# EAGLE schematic TK90X (EAGLE 7.4.0)
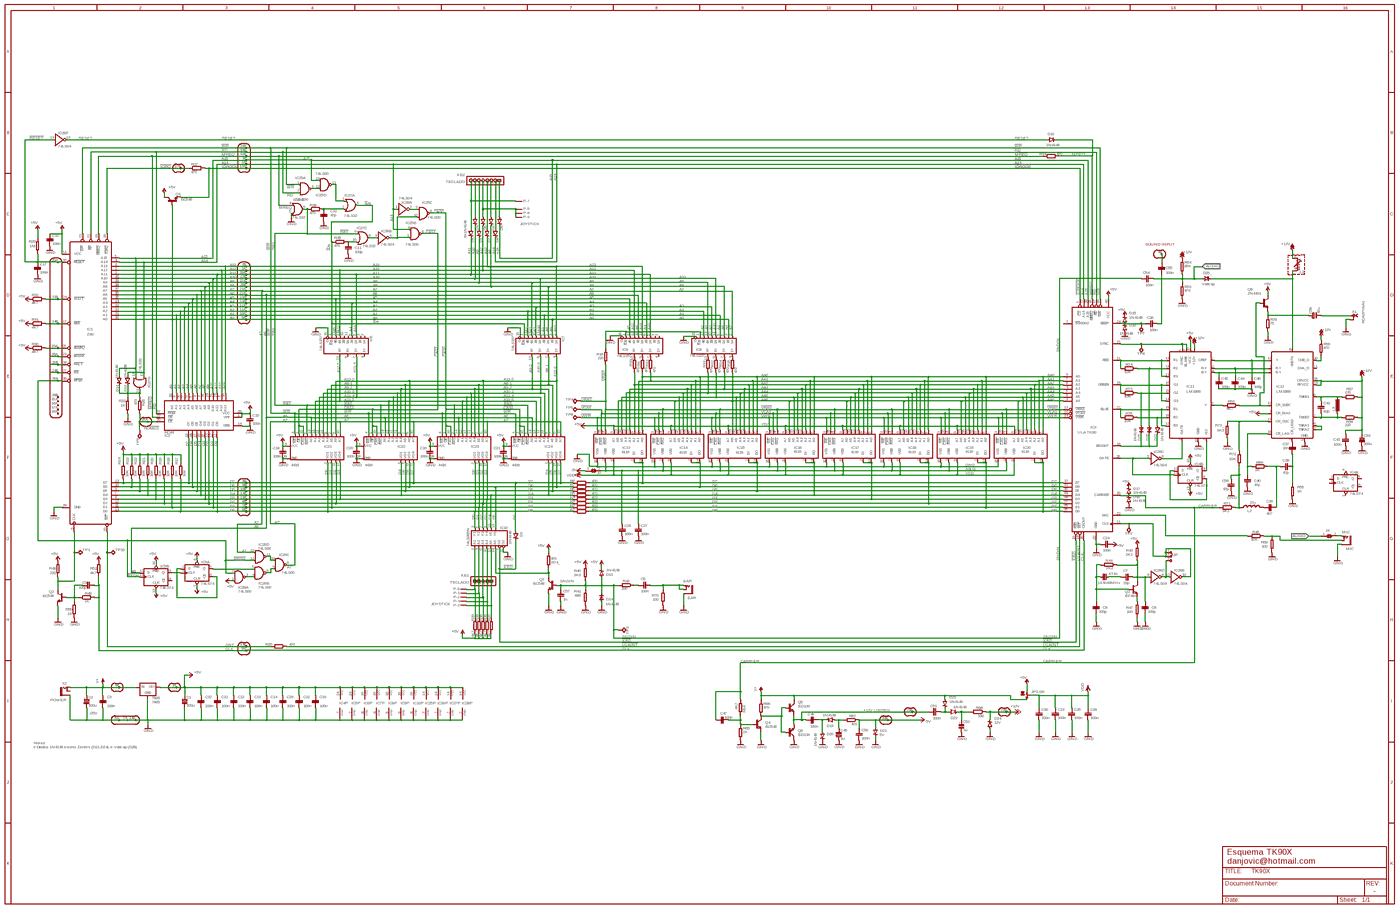
[diagram p0: schematic, sheet 1, overview]
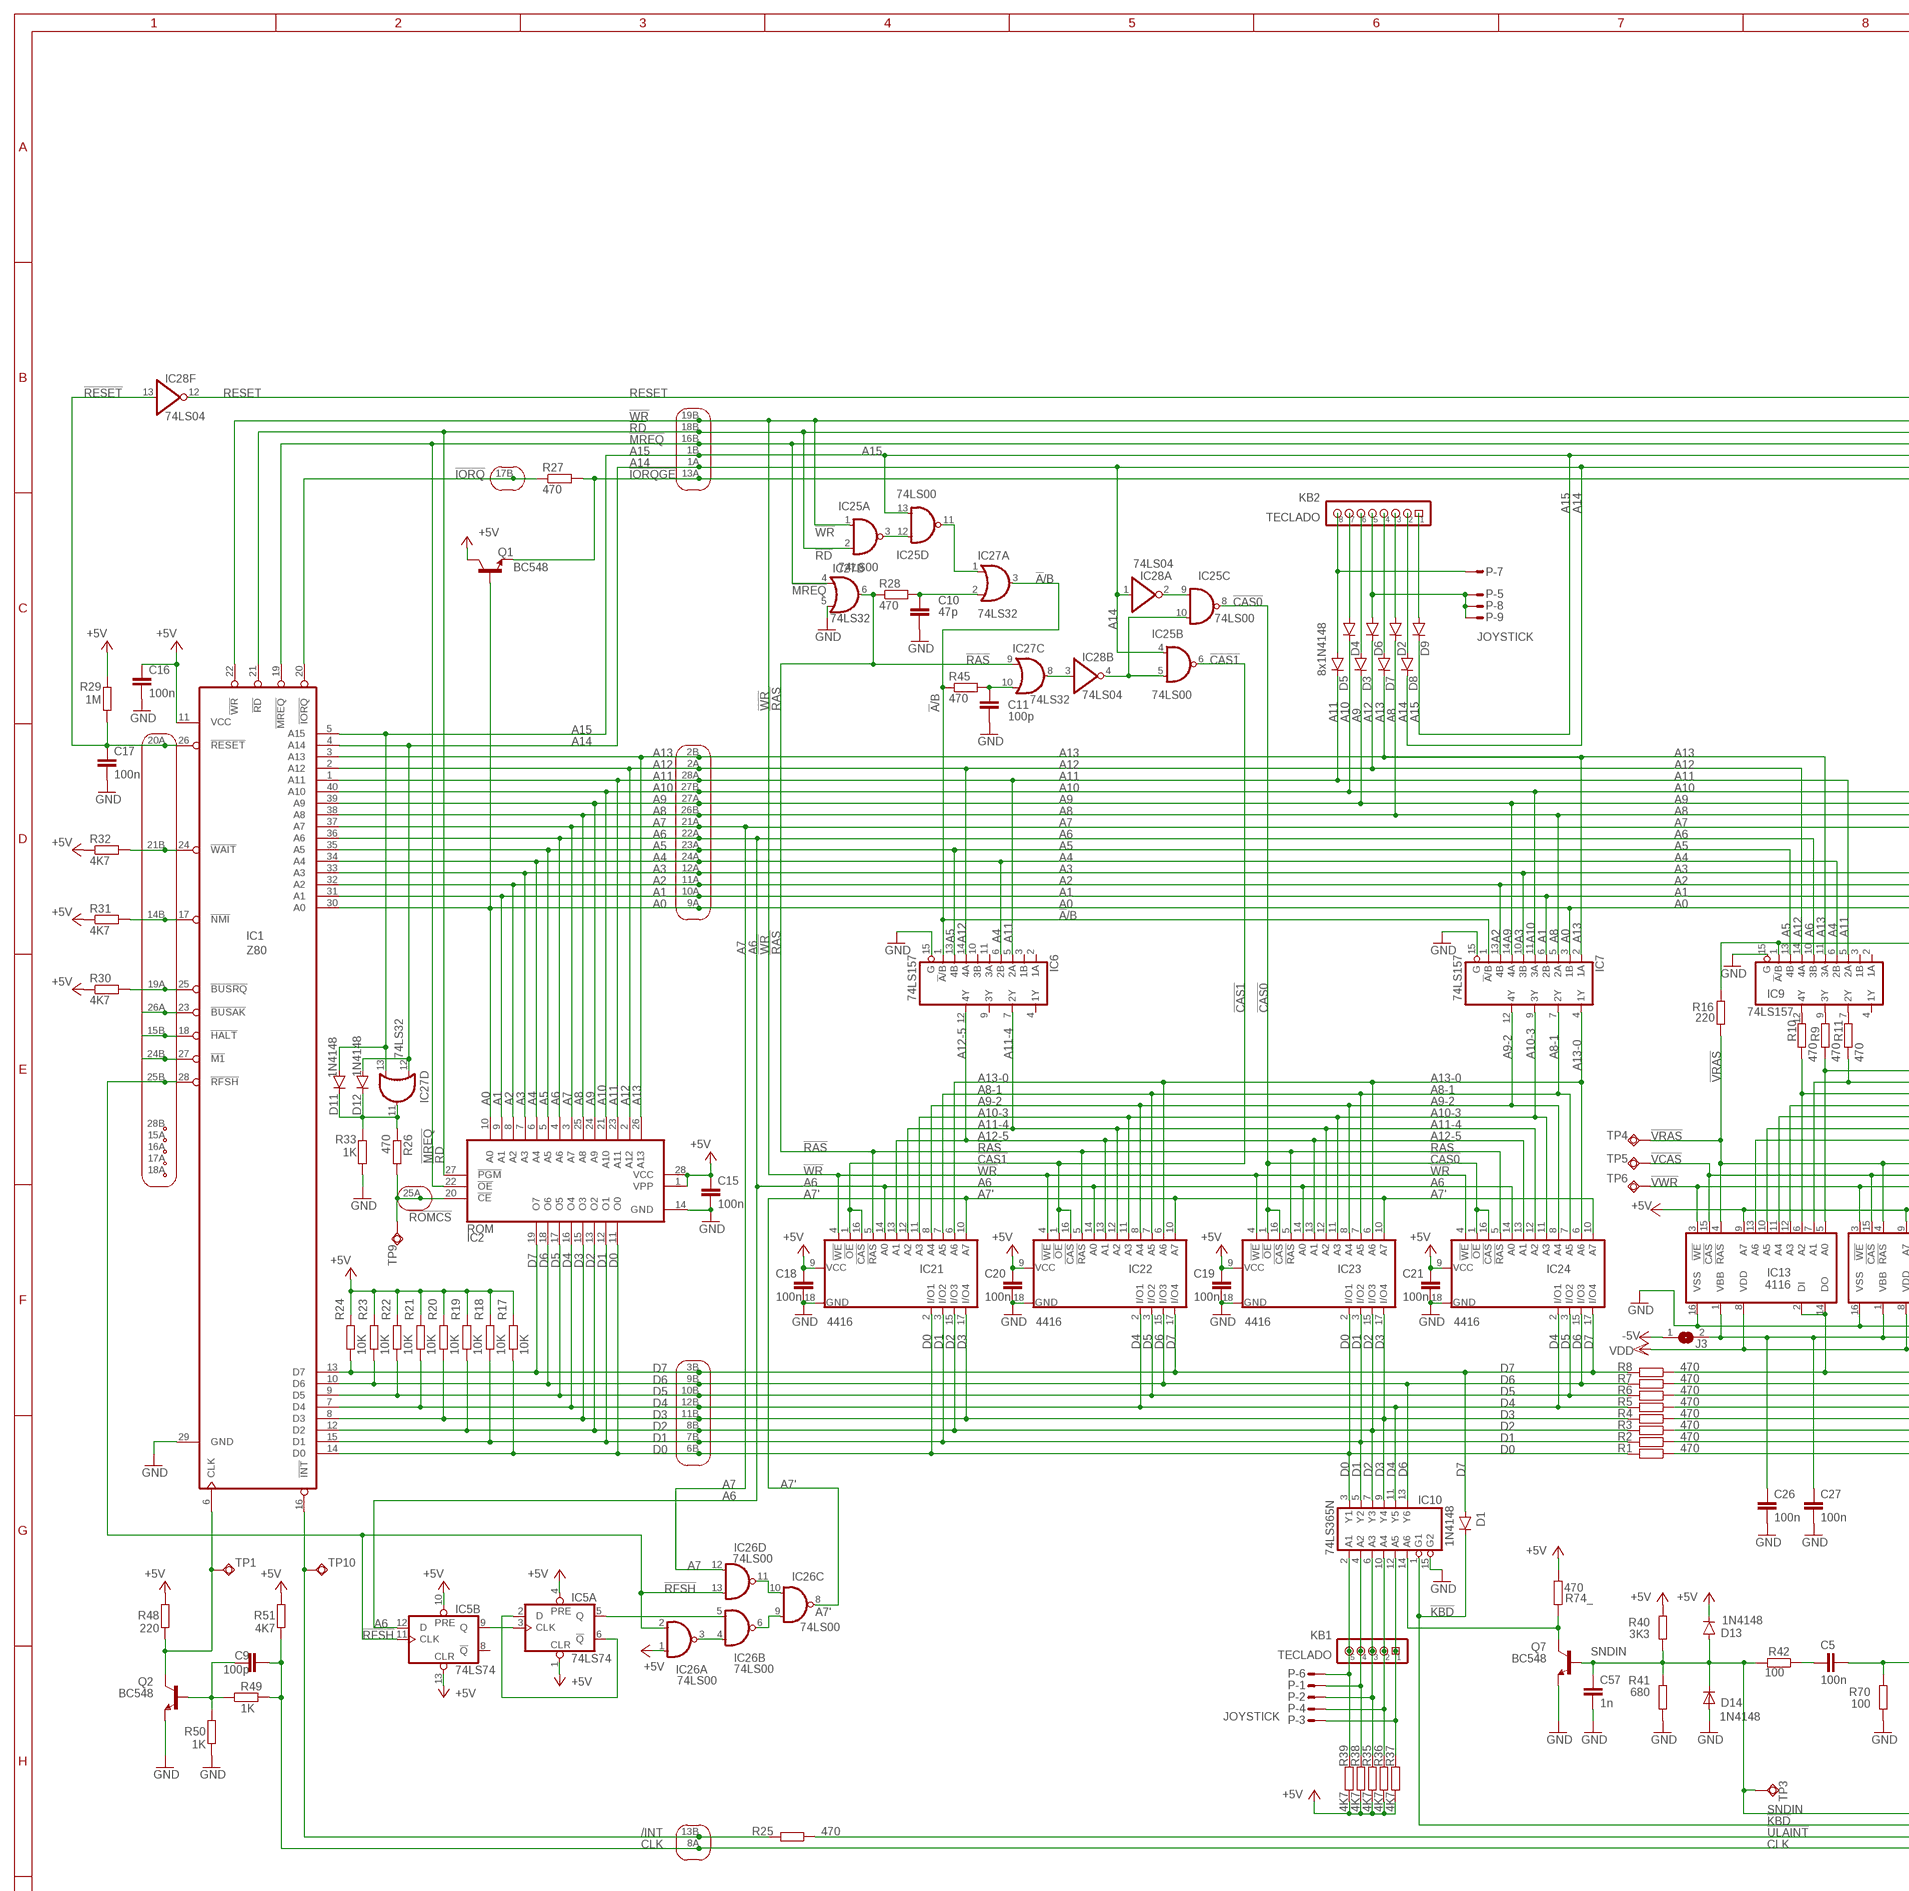
[diagram p1: schematic, sheet 1, part 1 of 4]
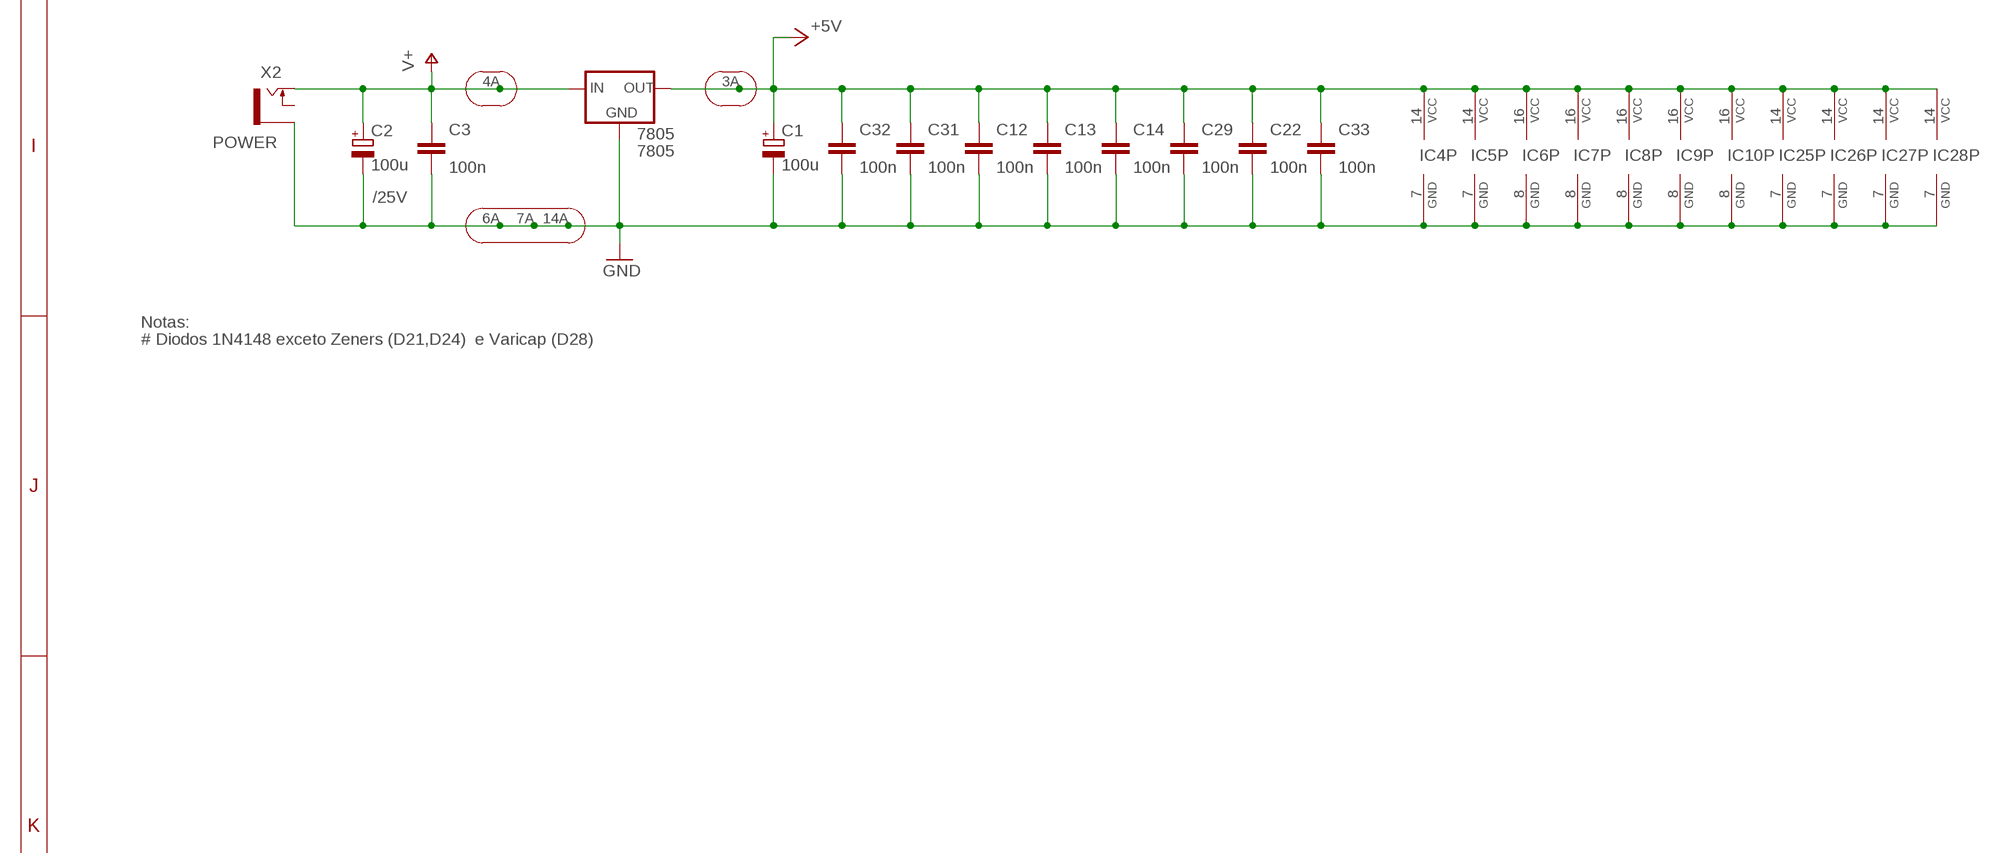
[diagram p2: schematic, sheet 1, part 2 of 4]
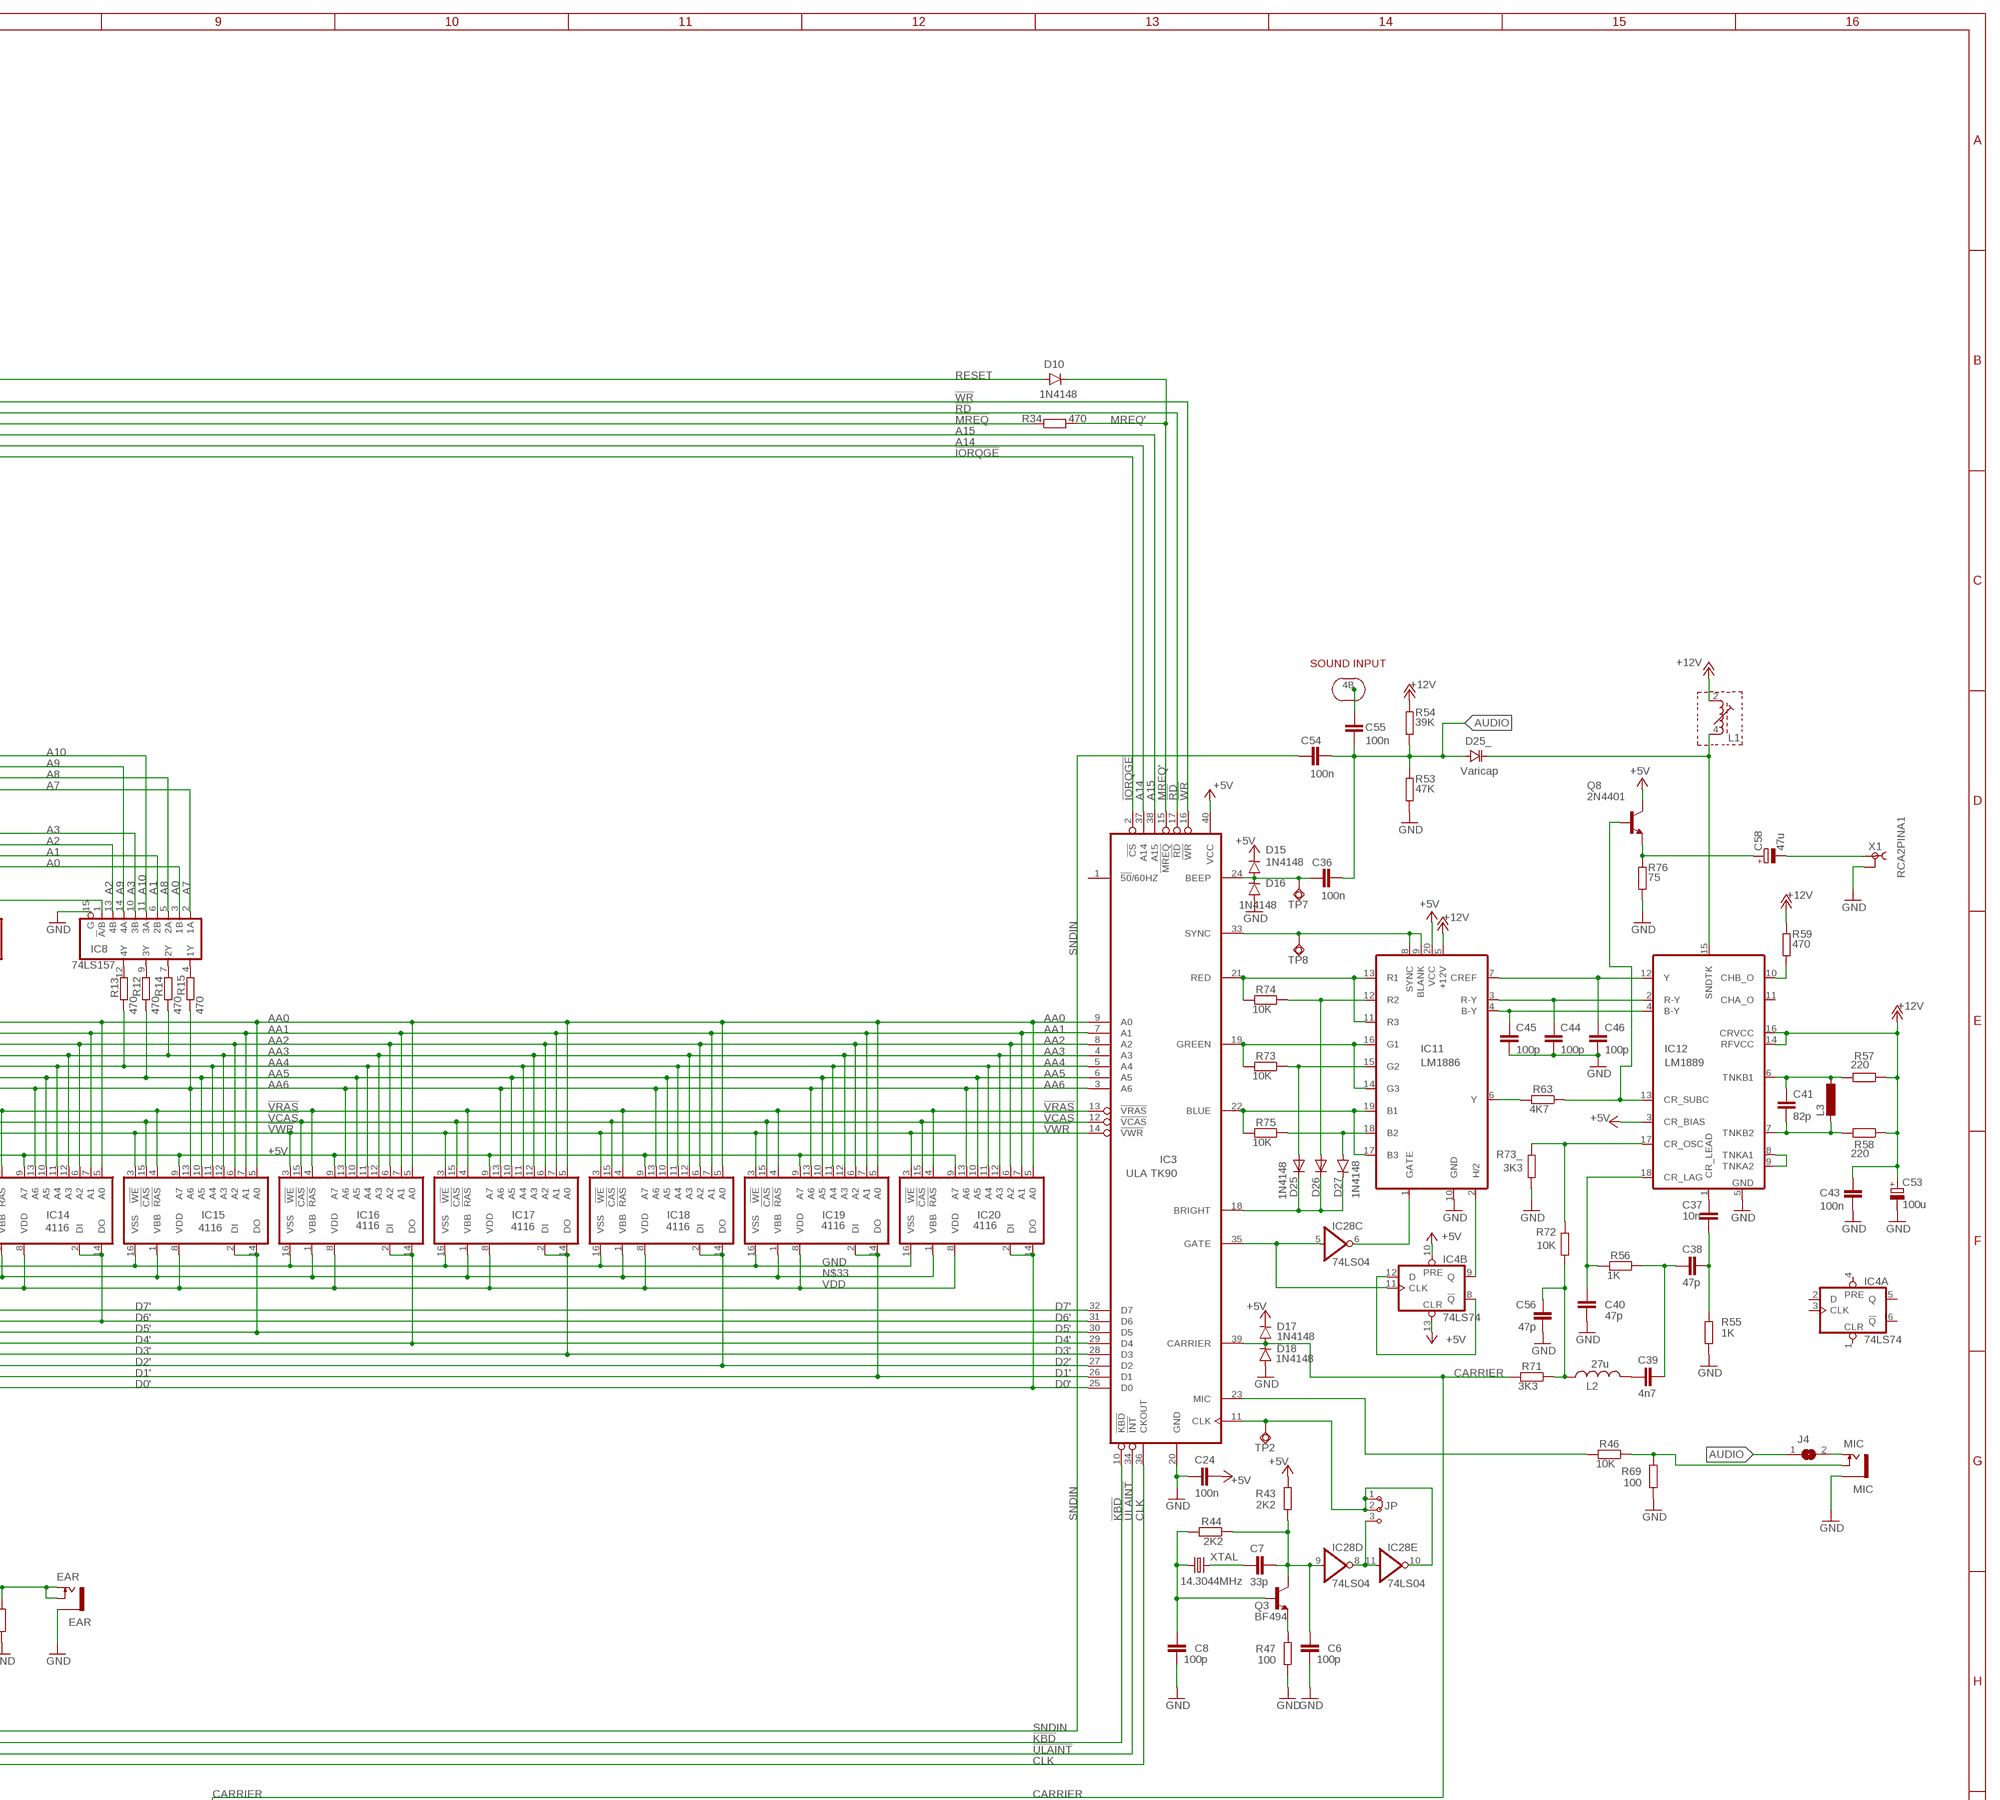
[diagram p3: schematic, sheet 1, part 3 of 4]
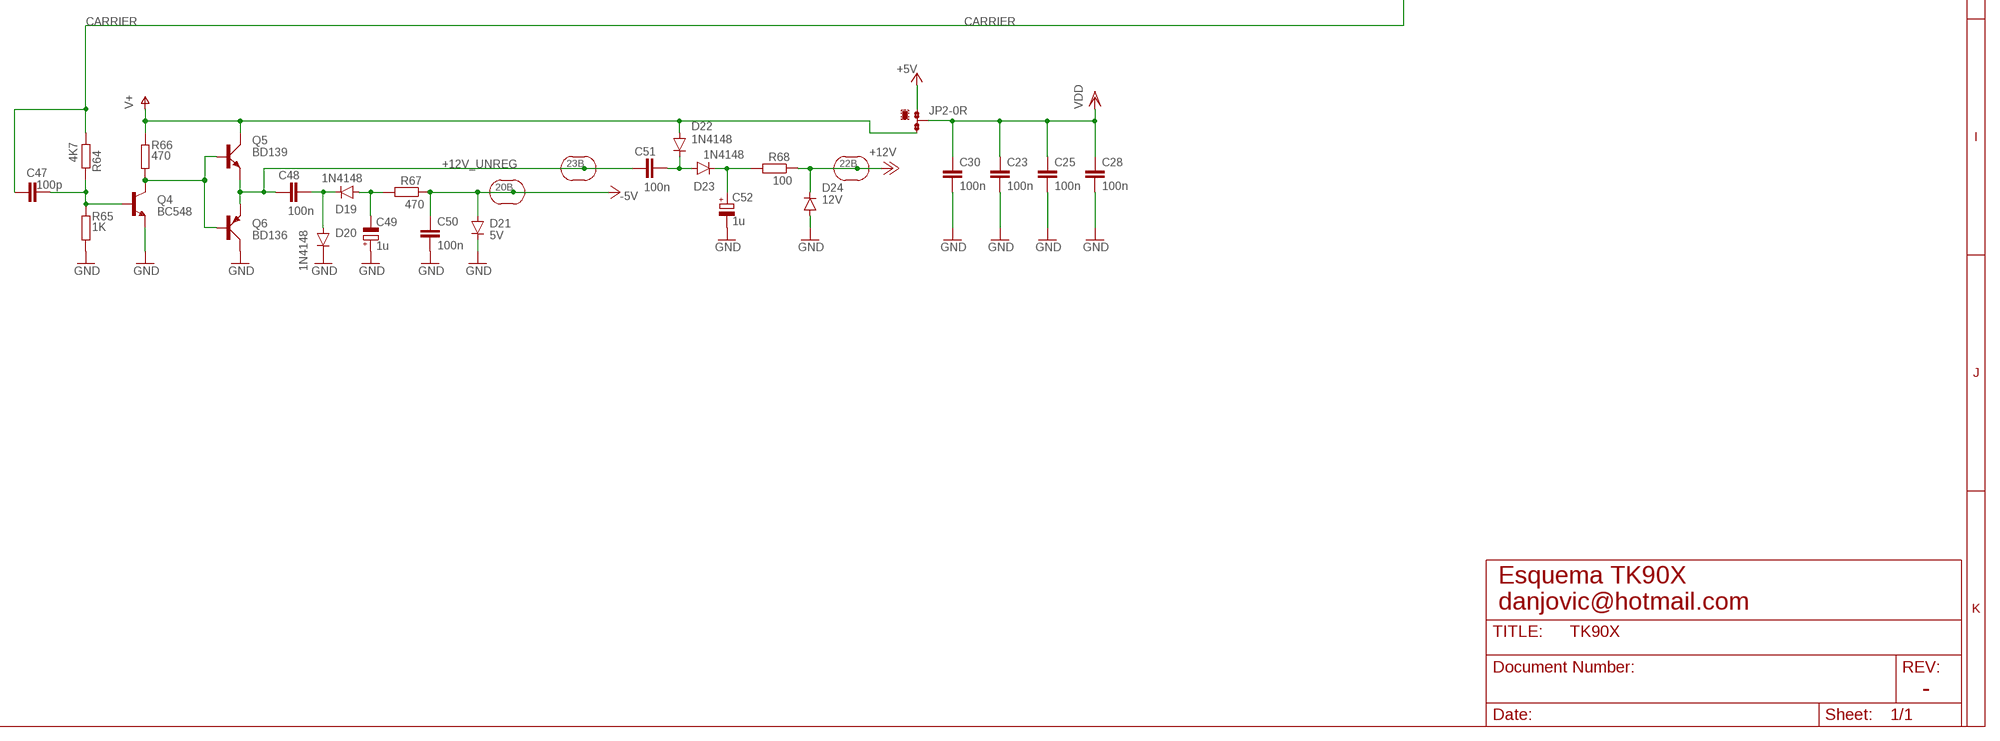
[diagram p4: schematic, sheet 1, part 4 of 4]

## Parts
7805  7805  78XXL  [78XXL]
C1  100u  CPOL-EUE5-8.5  [E5-8,5]
C2  100u  CPOL-EUE5-8.5  [E5-8,5]
C3  100n  C-EU050-024X044  [C050-024X044]
C5  100n  C-EU050-024X044  [C050-024X044]
C6  100p  C-EU050-024X044  [C050-024X044]
C7  33p  C-EU050-024X044  [C050-024X044]
C8  100p  C-EU050-024X044  [C050-024X044]
C9  100p  C-EU050-024X044  [C050-024X044]
C10  47p  C-EU050-024X044  [C050-024X044]
C11  100p  C-EU050-024X044  [C050-024X044]
C12  100n  C-EU050-024X044  [C050-024X044]
C13  100n  C-EU050-024X044  [C050-024X044]
C14  100n  C-EU050-024X044  [C050-024X044]
C15  100n  C-EU050-024X044  [C050-024X044]
C16  100n  C-EU050-024X044  [C050-024X044]
C17  100n  C-EU050-024X044  [C050-024X044]
C18  100n  C-EU050-024X044  [C050-024X044]
C19  100n  C-EU050-024X044  [C050-024X044]
C20  100n  C-EU050-024X044  [C050-024X044]
C21  100n  C-EU050-024X044  [C050-024X044]
C22  100n  C-EU050-024X044  [C050-024X044]
C23  100n  C-EU050-024X044  [C050-024X044]
C24  100n  C-EU050-024X044  [C050-024X044]
C25  100n  C-EU050-024X044  [C050-024X044]
C26  100n  C-EU050-024X044  [C050-024X044]
C27  100n  C-EU050-024X044  [C050-024X044]
C28  100n  C-EU050-024X044  [C050-024X044]
C29  100n  C-EU050-024X044  [C050-024X044]
C30  100n  C-EU050-024X044  [C050-024X044]
C31  100n  C-EU050-024X044  [C050-024X044]
C32  100n  C-EU050-024X044  [C050-024X044]
C33  100n  C-EU050-024X044  [C050-024X044]
C36  100n  C-EU050-024X044  [C050-024X044]
C37  10n  C-EU050-024X044  [C050-024X044]
C38  47p  C-EU050-024X044  [C050-024X044]
C39  4n7  C-EU050-024X044  [C050-024X044]
C40  47p  C-EU050-024X044  [C050-024X044]
C41  82p  C-EU050-024X044  [C050-024X044]
C43  100n  C-EU050-024X044  [C050-024X044]
C44  100p  C-EU050-024X044  [C050-024X044]
C45  100p  C-EU050-024X044  [C050-024X044]
C46  100p  C-EU050-024X044  [C050-024X044]
C47  100p  C-EU050-024X044  [C050-024X044]
C48  100n  C-EU050-024X044  [C050-024X044]
C49  1u  CPOL-EUE2-4  [E2-4]
C50  100n  C-EU050-024X044  [C050-024X044]
C51  100n  C-EU050-024X044  [C050-024X044]
C52  1u  CPOL-EUE2-5  [E2-5]
C53  100u  CPOL-EUE5-4  [E5-4]
C54  100n  C-EU050-024X044  [C050-024X044]
C55  100n  C-EU050-024X044  [C050-024X044]
C56  47p  C-EU050-024X044  [C050-024X044]
C57  1n  C-EU050-024X044  [C050-024X044]
C58  47u  CPOL-EUE5-4  [E5-4]
D1  1N4148  DDO35-12  [DO35-12]
D2  1N4148  DDO35-12  [DO35-12]
D3  1N4148  DDO35-12  [DO35-12]
D4  1N4148  DDO35-12  [DO35-12]
D5  1N4148  DDO35-12  [DO35-12]
D6  1N4148  DDO35-12  [DO35-12]
D7  1N4148  DDO35-12  [DO35-12]
D8  1N4148  DDO35-12  [DO35-12]
D9  1N4148  DDO35-12  [DO35-12]
D10  1N4148  DDO35-12  [DO35-12]
D11  1N4148  DDO35-12  [DO35-12]
D12  1N4148  DDO35-12  [DO35-12]
D13  1N4148  DDO35-12  [DO35-12]
D14  1N4148  DIODE-D-5  [D-5]
D15  1N4148  DDO35-12  [DO35-12]
D16  1N4148  DDO35-12  [DO35-12]
D17  1N4148  DDO35-12  [DO35-12]
D18  1N4148  DDO35-12  [DO35-12]
D19  1N4148  DDO35-12  [DO35-12]
D20  1N4148  DDO35-12  [DO35-12]
D21  5V  DDO35-12  [DO35-12]
D22  1N4148  DDO35-12  [DO35-12]
D23  1N4148  DDO35-12  [DO35-12]
D24  12V  DDO35-12  [DO35-12]
D25  1N4148  DIODE-D-5  [D-5]
D25_  Varicap  VARICAP-200  [D200]
D26  1N4148  DIODE-D-5  [D-5]
D27  1N4148  DDO35-12  [DO35-12]
EAR  EAR  JACK-MONO  [MONO]
IC1  Z80  Z80CPU  [DIL40]
IC2  ROM  25128  [DIL28]
IC3  ULA TK90  ULA-TK90  [DIL40]
IC4  74LS74  74LS74N  [DIL14]
IC5  74LS74  74LS74N  [DIL14]
IC6  74LS157  74S157N  [DIL16]
IC7  74LS157  74S157N  [DIL16]
IC8  74LS157  74S157N  [DIL16]
IC9  74LS157  74S157N  [DIL16]
IC10  74LS365N  [DIL16]
IC11  LM1886  LM1886N  [DIL20]
IC12  LM1889  [DIL18]
IC13  4116  MK4516  [DIL16]
IC14  4116  MK4516  [DIL16]
IC15  4116  MK4516  [DIL16]
IC16  4116  MK4516  [DIL16]
IC17  4116  MK4516  [DIL16]
IC18  4116  MK4516  [DIL16]
IC19  4116  MK4516  [DIL16]
IC20  4116  MK4516  [DIL16]
IC21  4416  [DIL18]
IC22  4416  [DIL18]
IC23  4416  [DIL18]
IC24  4416  [DIL18]
IC25  74LS00  74LS00N  [DIL14]
IC26  74LS00  74LS00N  [DIL14]
IC27  74LS32  74LS32N  [DIL14]
IC28  74LS04  74LS04N  [DIL14]
J3  SJ  [SJ]
J4  SJ  [SJ]
JP  J2X1MM  [03C]
JP2  0R-JUMPB  [B0R-JMP]
KB1  TECLADO  CON-TECL-5  [FE05-1]
KB2  TECLADO  CON-TECL-8  [FE08]
L1  COIL  [COIL]
L2  27u  L-US0207/7  [0207/7]
L3  L-EU0204/5  [0204/5]
MIC  MIC  JACK-MONO  [MONO]
P  JOYSTICK  M09.590S  [177-009-MALE]
Q1  BC548  -NPN-TO92L  [TO92L]
Q2  BC548  -NPN-TO92L  [TO92L]
Q3  BF494  [TO92-CEB]
Q4  BC548  -NPN-TO92L  [TO92L]
Q5  BD139  [TO126AV]
Q6  BD136  BD140  [TO126AV]
Q7  BC548  -NPN-TO92L  [TO92L]
Q8  2N4401  [TO92-EBC]
R1  470  R-EU_0207/12  [0207/12]
R2  470  R-EU_0207/12  [0207/12]
R3  470  R-EU_0207/12  [0207/12]
R4  470  R-EU_0207/12  [0207/12]
R5  470  R-EU_0207/12  [0207/12]
R6  470  R-EU_0207/12  [0207/12]
R7  470  R-EU_0207/12  [0207/12]
R8  470  R-EU_0207/12  [0207/12]
R9  470  R-EU_0207/12  [0207/12]
R10  470  R-EU_0207/12  [0207/12]
R11  470  R-EU_0207/12  [0207/12]
R12  470  R-EU_0207/12  [0207/12]
R13  470  R-EU_0207/12  [0207/12]
R14  470  R-EU_0207/12  [0207/12]
R15  470  R-EU_0207/12  [0207/12]
R16  220  R-EU_0207/12  [0207/12]
R17  10K  R-EU_0207/12  [0207/12]
R18  10K  R-EU_0207/12  [0207/12]
R19  10K  R-EU_0207/12  [0207/12]
R20  10K  R-EU_0207/12  [0207/12]
R21  10K  R-EU_0207/12  [0207/12]
R22  10K  R-EU_0207/12  [0207/12]
R23  10K  R-EU_0207/12  [0207/12]
R24  10K  R-EU_0207/12  [0207/12]
R25  470  R-EU_0207/12  [0207/12]
R26  470  R-EU_0207/12  [0207/12]
R27  470  R-EU_0207/12  [0207/12]
R28  470  R-EU_0207/12  [0207/12]
R29  1M  R-EU_0207/12  [0207/12]
R30  4K7  R-EU_0207/12  [0207/12]
R31  4K7  R-EU_0207/12  [0207/12]
R32  4K7  R-EU_0207/12  [0207/12]
R33  1K  R-EU_0207/12  [0207/12]
R34  470  R-EU_0207/12  [0207/12]
R35  4K7  R-EU_0207/12  [0207/12]
R36  4K7  R-EU_0207/12  [0207/12]
R37  4K7  R-EU_0207/12  [0207/12]
R38  4K7  R-EU_0207/12  [0207/12]
R39  4K7  R-EU_0207/12  [0207/12]
R40  3K3  R-EU_0207/12  [0207/12]
R41  680  R-EU_0207/5V  [0207/5V]
R42  100  R-EU_0207/5V  [0207/5V]
R43  2K2  R-EU_0207/12  [0207/12]
R44  2K2  R-EU_0207/12  [0207/12]
R45  470  R-EU_0207/12  [0207/12]
R46  10K  R-EU_0207/12  [0207/12]
R47  100  R-EU_0207/12  [0207/12]
R48  220  R-EU_0207/12  [0207/12]
R49  1K  R-EU_0207/12  [0207/12]
R50  1K  R-EU_0207/12  [0207/12]
R51  4K7  R-EU_0207/12  [0207/12]
R53  47K  R-EU_0207/12  [0207/12]
R54  39K  R-EU_0207/12  [0207/12]
R55  1K  R-EU_0207/5V  [0207/5V]
R56  1K  R-EU_0207/5V  [0207/5V]
R57  220  R-EU_0207/5V  [0207/5V]
R58  220  R-EU_0207/5V  [0207/5V]
R59  470  R-EU_0207/5V  [0207/5V]
R63  4K7  R-EU_0207/12  [0207/12]
R64  4K7  R-EU_0207/12  [0207/12]
R65  1K  R-EU_0207/12  [0207/12]
R66  470  R-EU_0207/12  [0207/12]
R67  470  R-EU_0207/12  [0207/12]
R68  100  R-EU_0207/12  [0207/12]
R69  100  R-EU_0207/5V  [0207/5V]
R70  100  R-EU_0207/5V  [0207/5V]
R71  3K3  R-EU_0207/5V  [0207/5V]
R72  10K  R-EU_0207/5V  [0207/5V]
R73  10K  R-EU_0207/5V  [0207/5V]
R73_  3K3  R-EU_0207/12  [0207/12]
R74  10K  R-EU_0207/5V  [0207/5V]
R74_  470  R-EU_0207/12  [0207/12]
R75  10K  R-EU_0207/12  [0207/12]
R76  75  R-EU_0207/5V  [0207/5V]
TP1  TPSQPAD1-13  [P1-13]
TP2  TPSQPAD1-13  [P1-13]
TP3  TPSQPAD1-13  [P1-13]
TP4  TPSQPAD1-13  [P1-13]
TP5  TPSQPAD1-13  [P1-13]
TP6  TPSQPAD1-13  [P1-13]
TP7  TPSQPAD1-13  [P1-13]
TP8  TPSQPAD1-13  [P1-13]
TP9  TPSQPAD1-13  [P1-13]
TP10  TPSQPAD1-13  [P1-13]
U$1  TK90_EDGE  [TK-EDGE]
X1  RCA2PINA1  [TOBU3]
X2  POWER  JACK-MONO  [MONO]
XTAL  14.3044MHz  CRYSTALHC49S  [HC49/S]

## Nets
!A!/B: IC6.1(!A!/B) IC7.1(!A!/B) IC27.3(A:O) R45.1
!BUSAK: IC1.23(!BUSAK) U$1.26A
!BUSRQ: IC1.25(!BUSRQ) R30.2 U$1.19A
!CAS0: IC23.1(!OE) IC23.16(!CAS) IC24.1(!OE) IC24.16(!CAS) IC25.8(C:O)
!CAS1: IC21.1(!OE) IC21.16(!CAS) IC22.1(!OE) IC22.16(!CAS) IC25.6(B:O)
!HALT: IC1.18(!HALT) U$1.15B
!IORQ: IC1.20(!IORQ) R27.1 U$1.17B
!IORQGE: IC3.2(!CS) Q1.1(E) R27.2 U$1.13A
!KBD: D1.C(K) IC3.10(!KBD) IC10.1(G1)
!M1: IC1.27(!M1) U$1.24B
!MREQ: IC1.19(!MREQ) IC2.22(!OE) IC27.4(B:I0) R34.1 U$1.16B
!NMI: IC1.17(!NMI) R31.2 U$1.14B
!RAS: IC21.5(!RAS) IC22.5(!RAS) IC23.5(!RAS) IC24.5(!RAS) IC27.6(B:O) IC27.9(C:I0) R28.1
!RD: IC1.21(!RD) IC2.27(!PGM) IC3.17(!RD) IC25.2(A:I1) U$1.18B
!RESET: C17.1 IC1.26(!RESET) IC28.13(F:I) R29.1 U$1.20A
!RFSH: IC1.28(!RFSH) IC5.11(B:CLK) IC26.2(A:I1) IC26.13(D:I1) U$1.25B
!ROMCS: IC2.20(!CE) R26.2 TP9.1(TP) U$1.25A
!ULAINT: IC3.34(!INT) R25.1
!VCAS: IC3.12(!VCAS) IC13.15(!CAS) IC14.15(!CAS) IC15.15(!CAS) IC16.15(!CAS) IC17.15(!CAS) IC18.15(!CAS) IC19.15(!CAS) IC20.15(!CAS) TP5.1(TP)
!VRAS: IC3.13(!VRAS) IC13.4(!RAS) IC14.4(!RAS) IC15.4(!RAS) IC16.4(!RAS) IC17.4(!RAS) IC18.4(!RAS) IC19.4(!RAS) IC20.4(!RAS) R16.2 TP4.1(TP)
!VWR: IC3.14(!VWR) IC13.3(!WE) IC14.3(!WE) IC15.3(!WE) IC16.3(!WE) IC17.3(!WE) IC18.3(!WE) IC19.3(!WE) IC20.3(!WE) TP6.1(TP)
!WAIT: IC1.24(!WAIT) R32.2 U$1.21B
!WR: IC1.22(!WR) IC3.16(!WR) IC21.4(!WE) IC22.4(!WE) IC23.4(!WE) IC24.4(!WE) IC25.1(A:I0) U$1.19B
+5V [power]: 7805.OUT C1.+ C12.2 C13.2 C14.2 C15.1 C16.1 C18.1 C19.1 C20.1 C21.1 C22.2 C24.2 C29.2 C31.2 C32.2 C33.2 D13.C(K) D15.C(K) D17.C(K) IC1.11(VCC) IC2.1(VPP) IC2.28(VCC) IC3.40(VCC) IC4.10(B:PRE) IC4.13(B:CLR) IC4.14(P:VCC) IC5.1(A:CLR) IC5.4(A:PRE) IC5.10(B:PRE) IC5.13(B:CLR) IC5.14(P:VCC) IC6.16(VCC) IC7.16(VCC) IC8.16(VCC) IC9.16(VCC) IC10.16(VCC) IC11.20(VCC) IC12.3(CR_BIAS) IC13.9(A7) IC14.9(A7) IC15.9(A7) IC16.9(A7) IC17.9(A7) IC18.9(A7) IC19.9(A7) IC20.9(A7) IC21.9(VCC) IC22.9(VCC) IC23.9(VCC) IC24.9(VCC) IC25.14(P:VCC) IC26.1(A:I0) IC26.14(P:VCC) IC27.14(P:VCC) IC28.14(P:VCC) JP2.1 Q1.3(C) Q8.C R17.2 R18.2 R19.2 R20.2 R21.2 R22.2 R23.2 R24.2 R29.2 R30.1 R31.1 R32.1 R35.1 R36.1 R37.1 R38.1 R39.1 R40.2 R43.2 R48.2 R51.2 R74_.2 U$1.3A
+12V [power]: C43.2 C53.+ D24.C(K) IC11.5(+12V) IC12.14(RFVCC) IC12.16(CRVCC) L1.2(A) R54.1 R57.1 R58.1 R59.1 R68.1 U$1.22B
+12V_UNREG: C48.1 C51.1 Q5.E Q6.E U$1.23B
-5V [power]: C50.1 D21.A J3.1 R67.1 U$1.20B
/INT: IC1.16(!INT) R25.2 TP10.1(TP) U$1.13B
A0: IC1.30(A0) IC2.10(A0) IC7.3(1B) IC8.3(1B) Q1.2(B) U$1.9A
A1: IC1.31(A1) IC2.9(A1) IC7.6(2B) IC8.6(2B) U$1.10A
A2: IC1.32(A2) IC2.8(A2) IC7.13(4B) IC8.13(4B) U$1.11A
A3: IC1.33(A3) IC2.7(A3) IC7.10(3B) IC8.10(3B) U$1.12A
A4: IC1.34(A4) IC2.6(A4) IC6.6(2B) IC9.6(2B) U$1.24A
A5: IC1.35(A5) IC2.5(A5) IC6.13(4B) IC9.13(4B) U$1.23A
A6: IC1.36(A6) IC2.4(A6) IC5.12(B:D) IC9.10(3B) IC21.14(A0) IC22.14(A0) IC23.14(A0) IC24.14(A0) U$1.22A
A7: IC1.37(A7) IC2.3(A7) IC8.2(1A) IC26.12(D:I0) U$1.21A
A7': IC21.10(A7) IC22.10(A7) IC23.10(A7) IC24.10(A7) IC26.8(C:O)
A8: D2.C(K) IC1.38(A8) IC2.25(A8) IC7.5(2A) IC8.5(2A) U$1.26B
A8-1: IC7.7(2Y) IC21.7(A5) IC22.7(A5) IC23.7(A5) IC24.7(A5)
A9: D3.C(K) IC1.39(A9) IC2.24(A9) IC7.14(4A) IC8.14(4A) U$1.27A
A9-2: IC7.12(4Y) IC21.8(A4) IC22.8(A4) IC23.8(A4) IC24.8(A4)
A10: D4.C(K) IC1.40(A10) IC2.21(A10) IC7.11(3A) IC8.11(3A) U$1.27B
A10-3: IC7.9(3Y) IC21.11(A3) IC22.11(A3) IC23.11(A3) IC24.11(A3)
A11: D5.C(K) IC1.1(A11) IC2.23(A11) IC6.5(2A) IC9.5(2A) U$1.28A
A11-4: IC6.7(2Y) IC21.12(A2) IC22.12(A2) IC23.12(A2) IC24.12(A2)
A12: D6.C(K) IC1.2(A12) IC2.2(A12) IC6.14(4A) IC9.14(4A) U$1.2A
A12-5: IC6.12(4Y) IC21.13(A1) IC22.13(A1) IC23.13(A1) IC24.13(A1)
A13: D7.C(K) IC1.3(A13) IC2.26(A13) IC7.2(1A) IC9.11(3A) U$1.2B
A13-0: IC7.4(1Y) IC21.6(A6) IC22.6(A6) IC23.6(A6) IC24.6(A6)
A14: D8.C(K) D12.A IC1.4(A14) IC3.37(A14) IC25.4(B:I0) IC27.12(D:I0) IC28.1(A:I) U$1.1A
A15: D9.C(K) D11.A IC1.5(A15) IC3.38(A15) IC25.13(D:I1) IC27.13(D:I1) U$1.1B
AA0: IC3.9(A0) IC13.5(A0) IC14.5(A0) IC15.5(A0) IC16.5(A0) IC17.5(A0) IC18.5(A0) IC19.5(A0) IC20.5(A0) R9.1
AA1: IC3.7(A1) IC13.7(A1) IC14.7(A1) IC15.7(A1) IC16.7(A1) IC17.7(A1) IC18.7(A1) IC19.7(A1) IC20.7(A1) R11.1
AA2: IC3.8(A2) IC13.6(A2) IC14.6(A2) IC15.6(A2) IC16.6(A2) IC17.6(A2) IC18.6(A2) IC19.6(A2) IC20.6(A2) R10.1
AA3: IC3.4(A3) IC13.12(A3) IC14.12(A3) IC15.12(A3) IC16.12(A3) IC17.12(A3) IC18.12(A3) IC19.12(A3) IC20.12(A3) R14.1
AA4: IC3.5(A4) IC13.11(A4) IC14.11(A4) IC15.11(A4) IC16.11(A4) IC17.11(A4) IC18.11(A4) IC19.11(A4) IC20.11(A4) R13.1
AA5: IC3.6(A5) IC13.10(A5) IC14.10(A5) IC15.10(A5) IC16.10(A5) IC17.10(A5) IC18.10(A5) IC19.10(A5) IC20.10(A5) R12.1
AA6: IC3.3(A6) IC13.13(A6) IC14.13(A6) IC15.13(A6) IC16.13(A6) IC17.13(A6) IC18.13(A6) IC19.13(A6) IC20.13(A6) R15.1
AUDIO: C36.2 C54.2 C55.1 D25_.A J4.1 R53.1 R54.2
BEEP: C36.1 D15.A D16.C(K) IC3.24(BEEP) TP7.1(TP)
CARRIER: C47.1 D17.A D18.C(K) IC3.39(CARRIER) R64.2 R71.2
CLK: C9.2 IC3.36(CKOUT) R49.2 R51.1 U$1.8A
D0: IC1.14(D0) IC2.11(O0) IC10.3(Y1) IC21.2(I/O1) IC23.2(I/O1) R1.2 R17.1 U$1.6B
D0': IC3.25(D0) IC20.2(DI) IC20.14(DO) R1.1
D1: IC1.15(D1) IC2.12(O1) IC10.5(Y2) IC21.3(I/O2) IC23.3(I/O2) R2.2 R18.1 U$1.7B
D1': IC3.26(D1) IC19.2(DI) IC19.14(DO) R2.1
D2: IC1.12(D2) IC2.13(O2) IC10.7(Y3) IC21.15(I/O3) IC23.15(I/O3) R3.2 R19.1 U$1.8B
D2': IC3.27(D2) IC18.2(DI) IC18.14(DO) R3.1
D3: IC1.8(D3) IC2.15(O3) IC10.9(Y4) IC21.17(I/O4) IC23.17(I/O4) R4.2 R20.1 U$1.11B
D3': IC3.28(D3) IC17.2(DI) IC17.14(DO) R4.1
D4: IC1.7(D4) IC2.16(O4) IC10.11(Y5) IC22.2(I/O1) IC24.2(I/O1) R5.2 R21.1 U$1.12B
D4': IC3.29(D4) IC16.2(DI) IC16.14(DO) R5.1
D5: IC1.9(D5) IC2.17(O5) IC22.3(I/O2) IC24.3(I/O2) R6.2 R22.1 U$1.10B
D5': IC3.30(D5) IC15.2(DI) IC15.14(DO) R6.1
D6: IC1.10(D6) IC2.18(O6) IC10.13(Y6) IC22.15(I/O3) IC24.15(I/O3) R7.2 R23.1 U$1.9B
D6': IC3.31(D6) IC14.2(DI) IC14.14(DO) R7.1
D7: D1.A IC1.13(D7) IC2.19(O7) IC22.17(I/O4) IC24.17(I/O4) R8.2 R24.1 U$1.3B
D7': IC3.32(D7) IC13.2(DI) IC13.14(DO) R8.1
D19: C48.2 D19.C(K) D20.A
GND [power]: 7805.GND C1.- C2.- C3.1 C6.1 C8.1 C10.2 C11.2 C12.1 C13.1 C14.1 C15.2 C16.2 C17.2 C18.2 C19.2 C20.2 C21.2 C22.1 C23.2 C24.1 C25.2 C26.2 C27.2 C28.2 C29.1 C30.2 C31.1 C32.1 C33.1 C40.1 C43.1 C44.2 C45.2 C46.2 C49.+ C50.2 C52.- C53.- C56.1 C57.2 D14.A D16.A D18.A D20.C(K) D21.C(K) D24.A EAR.RING(SHIELD) IC1.29(GND) IC2.14(GND) IC3.20(GND) IC4.7(P:GND) IC5.7(P:GND) IC6.8(GND) IC6.15(G) IC7.8(GND) IC7.15(G) IC8.8(GND) IC8.15(G) IC9.8(GND) IC9.15(G) IC10.8(GND) IC10.15(G2) IC11.10(GND) IC12.5(GND) IC13.16(VSS) IC14.16(VSS) IC15.16(VSS) IC16.16(VSS) IC17.16(VSS) IC18.16(VSS) IC19.16(VSS) IC20.16(VSS) IC21.18(GND) IC22.18(GND) IC23.18(GND) IC24.18(GND) IC25.7(P:GND) IC26.7(P:GND) IC27.5(B:I1) IC27.7(P:GND) IC28.7(P:GND) MIC.RING(SHIELD) Q2.1(E) Q4.1(E) Q6.C Q7.1(E) R33.2 R41.1 R47.1 R50.1 R53.2 R55.2 R65.2 R69.1 R70.1 R73_.2 R76.2 U$1.6A U$1.7A U$1.14A X1.SHELL X1.SHELL@1 X1.SHELL@2 X2.RING(SHIELD)
MREQ': D10.C(K) IC3.15(!MREQ) R34.2
N$1: IC5.3(A:CLK) IC5.9(B:Q)
N$2: IC5.2(A:D) IC5.6(A:!Q)
N$3: IC5.5(A:Q) IC26.5(B:I1)
N$4: IC26.3(A:O) IC26.4(B:I0)
N$5: IC26.10(C:I1) IC26.11(D:O)
N$6: IC26.6(B:O) IC26.9(C:I0)
N$7: IC25.3(A:O) IC25.12(D:I0)
N$8: IC10.2(A1) KB1.5 P.6 R39.2
N$9: C5.1 R42.1
N$10: D11.C(K) D12.C(K) IC27.11(D:O) R26.1 R33.1
N$11: C10.1 IC27.2(A:I1) R28.2
N$12: C11.1 IC27.10(C:I1) R45.2
N$13: IC25.5(B:I1) IC25.10(C:I1) IC28.4(B:O)
N$14: IC25.11(D:O) IC27.1(A:I0)
N$15: IC27.8(C:O) IC28.3(B:I)
N$16: C5.2 EAR.NC EAR.TIP R70.2
N$17: IC9.9(3Y) R9.2
N$18: C7.1 XTAL.2
N$19: IC9.12(4Y) R10.2
N$20: IC9.7(2Y) R11.2
N$21: IC8.9(3Y) R12.2
N$22: IC8.12(4Y) R13.2
N$23: IC25.9(C:I0) IC28.2(A:O)
N$24: IC10.4(A2) KB1.4 P.1 R38.2
N$25: IC10.6(A3) KB1.3 P.2 R35.2
N$26: C9.1 Q2.2(B) R49.1 R50.2
N$27: IC10.10(A4) KB1.2 P.4 R36.2
N$28: IC10.12(A5) KB1.1 P.3 R37.2
N$29: IC10.14(A6) Q7.3(C) R74_.1
N$30: IC8.7(2Y) R14.2
N$31: IC8.4(1Y) R15.2
N$32: IC8.1(!A!/B) IC9.1(!A!/B) R16.1
N$33 [power]: C26.1 C27.1 IC13.1(VBB) IC14.1(VBB) IC15.1(VBB) IC16.1(VBB) IC17.1(VBB) IC18.1(VBB) IC19.1(VBB) IC20.1(VBB) J3.2
N$34: D5.A KB2.8 P.7
N$35: D4.A KB2.7
N$36: D3.A KB2.6
N$37: Q3.E R47.2
N$38: D7.A KB2.4
N$39: D2.A KB2.3
N$40: D8.A KB2.2
N$41: D9.A KB2.1
N$42: D6.A KB2.5 P.5 P.8 P.9
N$43: C51.2 D22.C(K) D23.A
N$44: MIC.NC R46.1 R69.2
N$45: C6.2 C7.2 IC28.9(D:I) Q3.C R43.1 R44.1
N$46: IC28.8(D:O) IC28.11(E:I) JP.3
N$47: IC3.11(CLK) IC28.10(E:O) JP.1 JP.2 TP2.1(TP)
N$48: C58.+ Q8.E R76.1
N$49: IC3.23(MIC) R46.2
N$50: J4.2 MIC.TIP
N$51: C47.2 Q4.2(B) R64.1 R65.1
N$52: C55.2 U$1.4B
N$53: Q4.3(C) Q5.B Q6.B R66.2
N$54: IC3.33(SYNC) IC11.8(SYNC) IC11.9(BLANK) TP8.1(TP)
N$55: IC3.21(RED) IC11.11(R3) IC11.13(R1) R74.2
N$56: C49.- D19.A R67.2
N$57: C52.+ D23.C(K) R68.2
N$58: IC3.19(GREEN) IC11.14(G3) IC11.16(G1) R73.2
N$59: IC3.35(GATE) IC4.11(B:CLK) IC28.5(C:I)
N$60: IC3.22(BLUE) IC11.17(B3) IC11.19(B1) R75.2
N$61: D25.A IC11.15(G2) R73.1
N$62: D26.A IC11.12(R2) R74.1
N$63: D27.A IC11.18(B2) R75.1
N$64: D25.C D26.C D27.C(K) IC3.18(BRIGHT)
N$65: IC4.8(B:!Q) IC4.12(B:D)
N$66: IC11.6(Y) R63.2
N$67: IC11.1(GATE) IC28.6(C:O)
N$68: IC4.9(B:Q) IC11.2(H/2)
N$69: IC12.13(CR_SUBC) Q8.B R63.1
N$70: C46.1 IC11.7(CREF) IC12.12(Y)
N$71: C44.1 IC11.3(R-Y) IC12.2(R-Y)
N$72: C45.1 IC11.4(B-Y) IC12.4(B-Y)
N$73: IC12.10(CHB_O) R59.2
N$74: C58.- X1.PIN
N$75: D25_.K IC12.15(SNDTK) L1.4(E)
N$77: IC12.17(CR_OSC) R72.1 R73_.1
N$78: C40.2 IC12.18(CR_LAG) R56.2
N$79: C56.2 L2.1 R71.1 R72.2
N$80: C37.2 IC12.1(CR_LEAD)
N$81: C38.1 C39.2 R56.1
N$82: C37.1 C38.2 R55.1
N$83: C39.1 L2.2
N$85: IC12.8(TNKA1) IC12.9(TNKA2)
N$86: C41.1 IC12.7(TNKB2) L3.2 R58.2
N$87: C41.2 IC12.6(TNKB1) L3.1 R57.2
Q3: C8.2 Q3.B R44.2 XTAL.1
RESET: D10.A IC28.12(F:O)
SNDIN: C54.1 C57.1 D13.A D14.C Q7.2(B) R40.1 R41.2 R42.2 TP3.1(TP)
V+ [power]: 7805.IN C2.+ C3.2 D22.A JP2.3 Q5.C R66.1 U$1.4A X2.TIP
VDD [power]: C23.1 C25.1 C28.1 C30.1 IC13.8(VDD) IC14.8(VDD) IC15.8(VDD) IC16.8(VDD) IC17.8(VDD) IC18.8(VDD) IC19.8(VDD) IC20.8(VDD) JP2.2
Z80CLK: IC1.6(CLK) Q2.3(C) R48.1 TP1.1(TP)
Unconnected: IC3.1(!50!/60HZ) IC4.1(A:CLR) IC4.2(A:D) IC4.3(A:CLK) IC4.4(A:PRE) IC4.5(A:Q) IC4.6(A:!Q) IC5.8(B:!Q) IC6.2(1A) IC6.3(1B) IC6.4(1Y) IC6.9(3Y) IC6.10(3B) IC6.11(3A) IC9.2(1A) IC9.3(1B) IC9.4(1Y) IC12.11(CHA_O) L1.S1(S2) L1.S2(S1) U$1.15A U$1.16A U$1.17A U$1.18A U$1.28B X2.NC

## Notes on the sheet
- JOYSTICK
- 8x1N4148
- SOUND INPUT
- /25V
- Notas:
- # Diodos 1N4148 exceto Zeners (D21,D24)  e Varicap (D28)
- Esquema TK90X
- danjovic@hotmail.com
- -

## Library data of the parts
7805 = v-reg:78XXL: VOLTAGE REGULATOR
C1 C2 C49 C52 C53 C58 = rcl:CPOL-EU: POLARIZED CAPACITOR, European symbol
C3 C5-C33 C36-C41 C43-C48 C50 C51 C54-C57 = rcl:C-EU: CAPACITOR, European symbol
D1-D13 D15-D24 D27 = tk90:D*: Diodo
D14 D25 D26 = diode:DIODE-: DIODE
D25_ = tk90:VARICAP
EAR MIC X2 = tk90:JACK?: FEMALE PRINT CONNECTOR Niedervolt-Steckverbinder Distributor Conrad
IC1 = tk90:Z80CPU: Z80 FAMILY DEVICE
IC2 = tk90:25128
IC3 = tk90:ULA-TK90
IC4 IC5 = tk90:74*74: Dual D type positive edge triggered FLIP FLOP, preset and clear
IC6-IC9 = tk90:74*157: Quadruple 2-line to 1-line data SELECTOR/MULTIPLEXER
IC10 = tk90:74*365: Hex BUS DRIVER, 3-state
IC11 = tk90:LM1886
IC12 = tk90:LM1889
IC13-IC20 = tk90:MK4516
IC21-IC24 = tk90:4416: MEMORY
IC25 IC26 = tk90:74*00: Quad 2-input NAND gate
IC27 = tk90:74*32: Quad 2-input OR gate
IC28 = tk90:74*04: Hex INVERTER
J3 J4 = jumper:SJ: SMD solder JUMPER
JP = tk90:J2: Jumper switch 2 x 2.5 mm
JP2 = jump-0r-smd:0R-JUMP: SMD 0R 0805 Jumper
KB1 = tk90:CON-TECL-5: FEMALE HEADER
KB2 = tk90:CON-TECL-8: FEMALE HEADER
L1 = tk90:COIL: FILTER pre-adjusted RF filter, type K, standard value E-12
L2 = rcl:L-US: INDUCTOR, American symbol
L3 = rcl:L-EU: INDUCTOR, European symbol
P = tk90:M09?S: SUB-D; OC_FARNELL: unknown; OC_NEWARK: unknown
Q1 Q2 Q4 Q7 = transistor:*-NPN-: NPN Transistror BF959 corrected 2008.03.06
Q3 = tk90:BF494: NPN TRANSISTOR
Q5 = transistor-power:BD139: NPN TRANSISTOR
Q6 = transistor-power:BD140: PNP TRANSISTOR
Q8 = tk90:2N4401: 2N4401 NPN transistor
R1-R51 R53-R59 R63-R73 R73_ R74 R74_ R75 R76 = rcl:R-EU_: RESISTOR, European symbol
TP1-TP10 = testpad:TPSQ: Test pad
U$1 = tk90:TK90_EDGE
X1 = tk90:RCA2PIN: Female Cinch CONNECTOR ( RCA Jack ); MF: FARNELL; MPN: TOBU 3; OC_FARNELL: 592791; OC_NEWARK: 06WX5914
XTAL = crystal:CRYSTAL: CRYSTAL

## Net classes
1 power: width 0.711 mm, drill 0.508 mm